# Altium project 1x9x1.PrjPcb
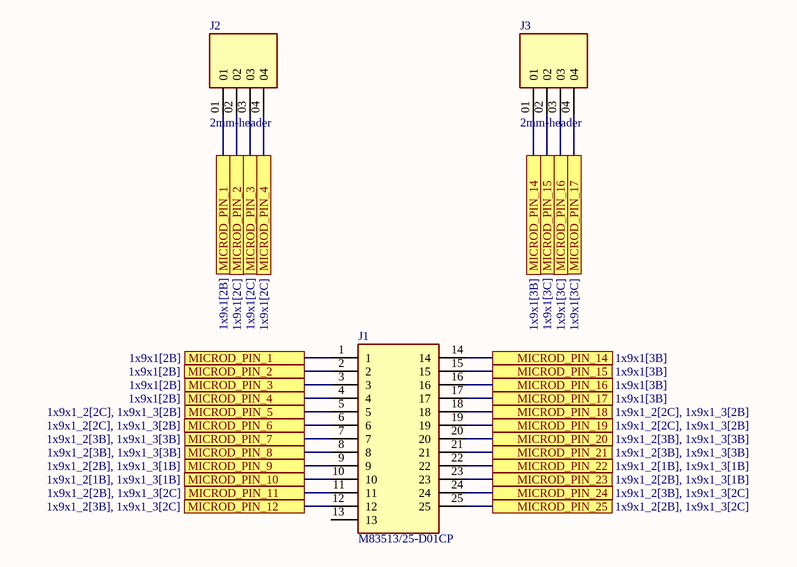
[diagram p0: 1x9x1.SchDoc]
3 sheets, 40 parts. Net scope: flat (ports and power ports of the same name join across sheets).
Board file: 1x9x1.PcbDoc
Sheets:
  1x9x1.SchDoc
  1x9x1_2.SchDoc
  1x9x1_3.SchDoc

## Sheet 1x9x1.SchDoc
size A; SheetNumber: 1; SheetTotal: 3

### Parts
J1  M83513/25-D01CP  [BEL_M83513/25-D01CP]
J2  2mm-header  [2mm-header]
J3  2mm-header  [2mm-header]

### Ports
MICROD_PIN_1 (see 1x9x1[2B]), MICROD_PIN_2 (see 1x9x1[2B]), MICROD_PIN_2 (see 1x9x1[2C]), MICROD_PIN_3 (see 1x9x1[2B]), MICROD_PIN_3 (see 1x9x1[2C]), MICROD_PIN_4 (see 1x9x1[2B]), MICROD_PIN_4 (see 1x9x1[2C]), MICROD_PIN_5 (see 1x9x1_2[2C], 1x9x1_3[2B]), MICROD_PIN_6 (see 1x9x1_2[2C], 1x9x1_3[2B]), MICROD_PIN_7 (see 1x9x1_2[3B], 1x9x1_3[3B]), MICROD_PIN_8 (see 1x9x1_2[3B], 1x9x1_3[3B]), MICROD_PIN_9 (see 1x9x1_2[2B], 1x9x1_3[1B]), MICROD_PIN_10 (see 1x9x1_2[1B], 1x9x1_3[1B]), MICROD_PIN_11 (see 1x9x1_2[2B], 1x9x1_3[2C]), MICROD_PIN_12 (see 1x9x1_2[3B], 1x9x1_3[2C]), MICROD_PIN_14 (see 1x9x1[3B]), MICROD_PIN_15 (see 1x9x1[3B]), MICROD_PIN_15 (see 1x9x1[3C]), MICROD_PIN_16 (see 1x9x1[3B]), MICROD_PIN_16 (see 1x9x1[3C]), MICROD_PIN_17 (see 1x9x1[3B]), MICROD_PIN_17 (see 1x9x1[3C]), MICROD_PIN_18 (see 1x9x1_2[2C], 1x9x1_3[2B]), MICROD_PIN_19 (see 1x9x1_2[2C], 1x9x1_3[2B]), MICROD_PIN_20 (see 1x9x1_2[3B], 1x9x1_3[3B]), MICROD_PIN_21 (see 1x9x1_2[3B], 1x9x1_3[3B]), MICROD_PIN_22 (see 1x9x1_2[1B], 1x9x1_3[1B]), MICROD_PIN_23 (see 1x9x1_2[2B], 1x9x1_3[1B]), MICROD_PIN_24 (see 1x9x1_2[3B], 1x9x1_3[2C]), MICROD_PIN_25 (see 1x9x1_2[2B], 1x9x1_3[2C])

### Nets
NetJ1_1: J1.1 J2.01 ; port MICROD_PIN_1
NetJ1_2: J1.2 J2.02 ; port MICROD_PIN_2
NetJ1_3: J1.3 J2.03 ; port MICROD_PIN_3
NetJ1_4: J1.4 J2.04 ; port MICROD_PIN_4
NetJ1_5: J1.5 ; port MICROD_PIN_5
NetJ1_6: J1.6 ; port MICROD_PIN_6
NetJ1_7: J1.7 ; port MICROD_PIN_7
NetJ1_8: J1.8 ; port MICROD_PIN_8
NetJ1_9: J1.9 ; port MICROD_PIN_9
NetJ1_10: J1.10 ; port MICROD_PIN_10
NetJ1_11: J1.11 ; port MICROD_PIN_11
NetJ1_12: J1.12 ; port MICROD_PIN_12
NetJ1_14: J1.14 J3.01 ; port MICROD_PIN_14
NetJ1_15: J1.15 J3.02 ; port MICROD_PIN_15
NetJ1_16: J1.16 J3.03 ; port MICROD_PIN_16
NetJ1_17: J1.17 J3.04 ; port MICROD_PIN_17
NetJ1_18: J1.18 ; port MICROD_PIN_18
NetJ1_19: J1.19 ; port MICROD_PIN_19
NetJ1_20: J1.20 ; port MICROD_PIN_20
NetJ1_21: J1.21 ; port MICROD_PIN_21
NetJ1_22: J1.22 ; port MICROD_PIN_22
NetJ1_23: J1.23 ; port MICROD_PIN_23
NetJ1_24: J1.24 ; port MICROD_PIN_24
NetJ1_25: J1.25 ; port MICROD_PIN_25

Not connected (* = marked no-connect by the designer): J1 13

### Library data of the parts
J1 = M83513/25-D01CP: MIL-DTL-83513 PCB Mounted Connector | Socket | 25 Positions | Shell Finish - Cadmium | Female | PCB Solder Pins | 0.109" (2.77 mm) Pin Length; Package: None; Price: None; Value: *; MP: M83513/25-D01CP; Availability: Unavailable
J2 J3 = 2mm-header: <a href="https://pricing.snapeda.com/parts/TSW-104-07-G-S/Samtec/view-part?ref=eda">Check availability</a>; MP: altium_native_batch; Package: None; Price: None; Value: *; Availability: Unavailable

## Sheet 1x9x1_2.SchDoc
size A; SheetNumber: 2; SheetTotal: 3
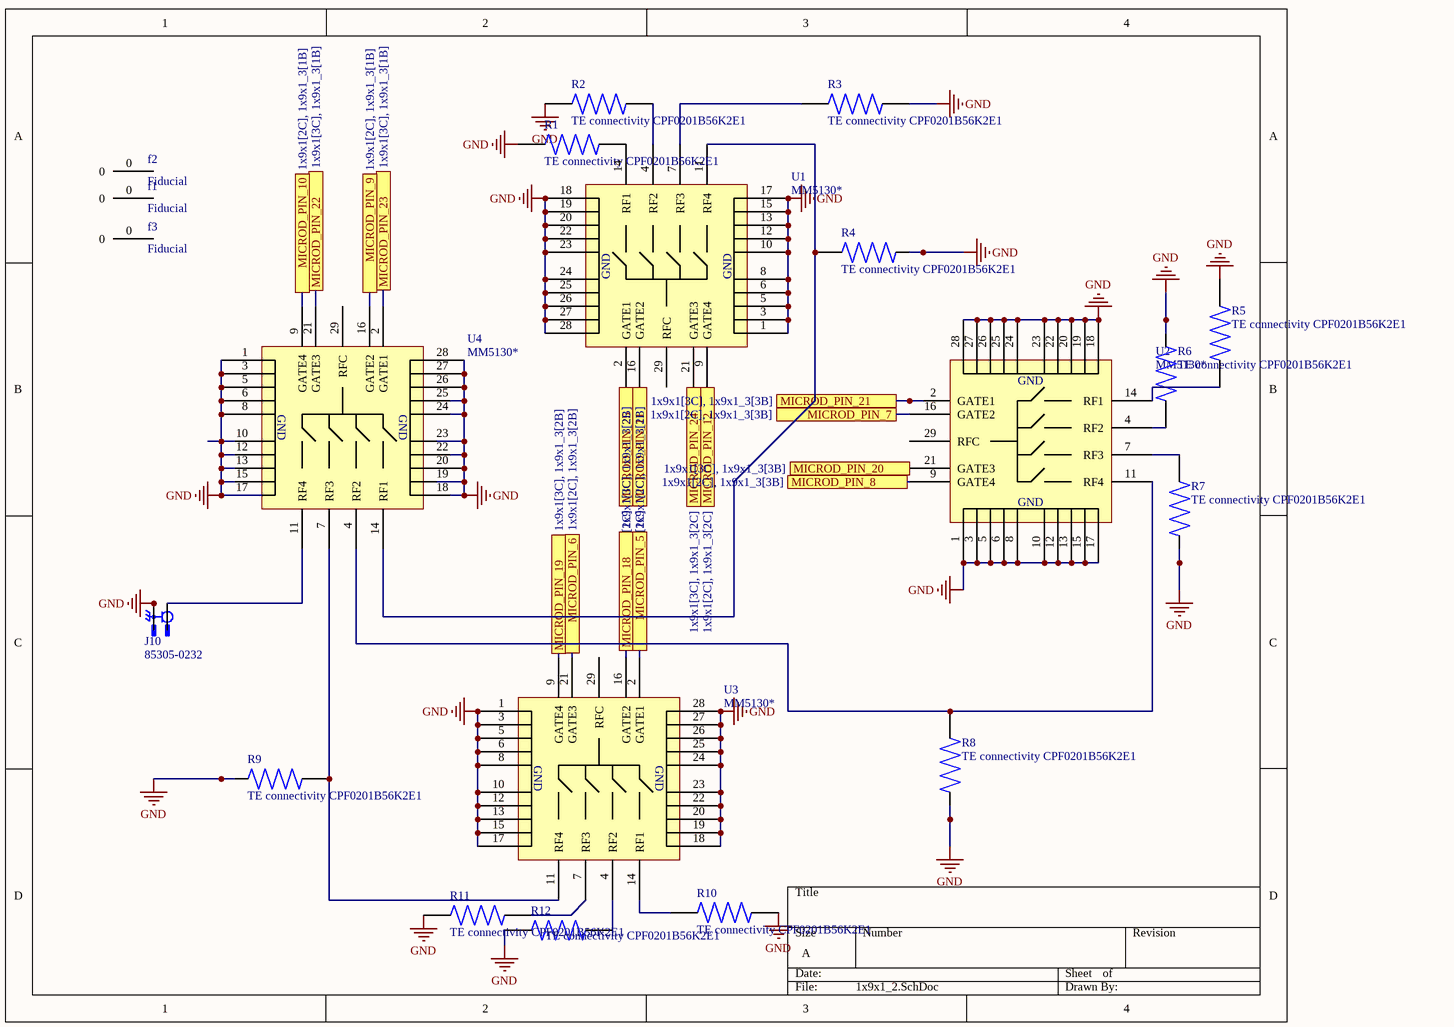
[diagram p1: 1x9x1_2.SchDoc]

### Parts
f1  Fiducial  [fiducial]
f2  Fiducial  [fiducial]
f3  Fiducial  [fiducial]
J10  85305-0232  [MOLEX_85305-0232]
R1  TE connectivity CPF0201B56K2E1  [0201-resistor]
R2  TE connectivity CPF0201B56K2E1  [0201-resistor]
R3  TE connectivity CPF0201B56K2E1  [0201-resistor]
R4  TE connectivity CPF0201B56K2E1  [0201-resistor]
R5  TE connectivity CPF0201B56K2E1  [0201-resistor]
R6  TE connectivity CPF0201B56K2E1  [0201-resistor]
R7  TE connectivity CPF0201B56K2E1  [0201-resistor]
R8  TE connectivity CPF0201B56K2E1  [0201-resistor]
R9  TE connectivity CPF0201B56K2E1  [0201-resistor]
R10  TE connectivity CPF0201B56K2E1  [0201-resistor]
R11  TE connectivity CPF0201B56K2E1  [0201-resistor]
R12  TE connectivity CPF0201B56K2E1  [0201-resistor]
U1  MM5130*  [MM5130-NORM_PCB_NOFLOOD]
U2  MM5130*  [MM5130-NORM_PCB_NOFLOOD]
U3  MM5130*  [MM5130-NORM_PCB_NOFLOOD]
U4  MM5130*  [MM5130-NORM_PCB_NOFLOOD]

### Ports
MICROD_PIN_5 (see 1x9x1[2C], 1x9x1_3[2B]), MICROD_PIN_6 (see 1x9x1[2C], 1x9x1_3[2B]), MICROD_PIN_7 (see 1x9x1[2C], 1x9x1_3[3B]), MICROD_PIN_8 (see 1x9x1[2C], 1x9x1_3[3B]), MICROD_PIN_9 (see 1x9x1[2C], 1x9x1_3[1B]), MICROD_PIN_10 (see 1x9x1[2C], 1x9x1_3[1B]), MICROD_PIN_11 (see 1x9x1[2C], 1x9x1_3[2C]), MICROD_PIN_12 (see 1x9x1[2C], 1x9x1_3[2C]), MICROD_PIN_18 (see 1x9x1[3C], 1x9x1_3[2B]), MICROD_PIN_19 (see 1x9x1[3C], 1x9x1_3[2B]), MICROD_PIN_20 (see 1x9x1[3C], 1x9x1_3[3B]), MICROD_PIN_21 (see 1x9x1[3C], 1x9x1_3[3B]), MICROD_PIN_22 (see 1x9x1[3C], 1x9x1_3[1B]), MICROD_PIN_23 (see 1x9x1[3C], 1x9x1_3[1B]), MICROD_PIN_24 (see 1x9x1[3C], 1x9x1_3[2C]), MICROD_PIN_25 (see 1x9x1[3C], 1x9x1_3[2C])

### Nets
GND: J10.2 J10.3 J10.4 J10.5 J10.6 J10.7 J10.8 J10.9 J10.10 J10.11 J10.12 J10.13 J10.14 J10.15 J10.16 J10.17 J10.18 R1.1 R2.2 R3.1 R4.1 R5.1 R6.1 R7.2 R8.2 R9.2 R10.1 R11.1 R12.2 U1.1(GND) U1.3(GND) U1.5(GND) U1.6(GND) U1.8(GND) U1.10(GND) U1.12(GND) U1.13(GND) U1.15(GND) U1.17(GND) U1.18(GND) U1.19(GND) U1.20(GND) U1.22(GND) U1.23(GND) U1.24(GND) U1.25(GND) U1.26(GND) U1.27(GND) U1.28(GND) U2.1(GND) U2.3(GND) U2.5(GND) U2.6(GND) U2.8(GND) U2.10(GND) U2.12(GND) U2.13(GND) U2.15(GND) U2.17(GND) U2.18(GND) U2.19(GND) U2.20(GND) U2.22(GND) U2.23(GND) U2.24(GND) U2.25(GND) U2.26(GND) U2.27(GND) U2.28(GND) U3.1(GND) U3.3(GND) U3.5(GND) U3.6(GND) U3.8(GND) U3.10(GND) U3.12(GND) U3.13(GND) U3.15(GND) U3.17(GND) U3.18(GND) U3.19(GND) U3.20(GND) U3.22(GND) U3.23(GND) U3.24(GND) U3.25(GND) U3.26(GND) U3.27(GND) U3.28(GND) U4.1(GND) U4.3(GND) U4.5(GND) U4.6(GND) U4.8(GND) U4.10(GND) U4.12(GND) U4.13(GND) U4.15(GND) U4.17(GND) U4.18(GND) U4.19(GND) U4.20(GND) U4.22(GND) U4.23(GND) U4.24(GND) U4.25(GND) U4.26(GND) U4.27(GND) U4.28(GND)
NetJ1_5: U3.2(GATE1) ; port MICROD_PIN_5
NetJ1_6: U3.21(GATE3) ; port MICROD_PIN_6
NetJ1_7: U2.16(GATE2) ; port MICROD_PIN_7
NetJ1_8: U2.9(GATE4) ; port MICROD_PIN_8
NetJ1_9: U4.16(GATE2) ; port MICROD_PIN_9
NetJ1_10: U4.9(GATE4) ; port MICROD_PIN_10
NetJ1_11: U1.16(GATE2) ; port MICROD_PIN_11
NetJ1_12: U1.9(GATE4) ; port MICROD_PIN_12
NetJ1_18: U3.16(GATE2) ; port MICROD_PIN_18
NetJ1_19: U3.9(GATE4) ; port MICROD_PIN_19
NetJ1_20: U2.21(GATE3) ; port MICROD_PIN_20
NetJ1_21: U2.2(GATE1) ; port MICROD_PIN_21
NetJ1_22: U4.21(GATE3) ; port MICROD_PIN_22
NetJ1_23: U4.2(GATE1) ; port MICROD_PIN_23
NetJ1_24: U1.21(GATE3) ; port MICROD_PIN_24
NetJ1_25: U1.2(GATE1) ; port MICROD_PIN_25
NetJ10_1: J10.1 U4.11(RF4)
NetR1_2: R1.2 U1.14(RF1)
NetR2_1: R2.1 U1.4(RF2)
NetR3_2: R3.2 U1.7(RF3)
NetR4_2: R4.2 U1.11(RF4) U4.14(RF1)
NetR5_2: R5.2 U2.14(RF1)
NetR6_2: R6.2 U2.4(RF2)
NetR7_1: R7.1 U2.7(RF3)
NetR8_1: R8.1 U2.11(RF4) U4.4(RF2)
NetR9_1: R9.1 U3.11(RF4) U4.7(RF3)
NetR10_2: R10.2 U3.14(RF1)
NetR11_2: R11.2 U3.7(RF3)
NetR12_1: R12.1 U3.4(RF2)

Not connected (* = marked no-connect by the designer): f1 0; f2 0; f3 0; U1 29(RFC); U2 29(RFC); U3 29(RFC); U4 29(RFC)

### Library data of the parts
J10 = 85305-0232: SMP Connector Plug, Male Pin 50Ohm Surface Mount Solder; MP: 853050232; MF: Molex; Check_prices: https://www.snapeda.com/parts/853050232/Molex/view-part/?ref=eda; Value: *; Availability: In Stock; Price: None; Package: None; SnapEDA_Link: https://www.snapeda.com/parts/853050232/Molex/view-part/?ref=snap; Purchase-URL: https://pricing.snapeda.com/search/part/853050232/?ref=eda
R1-R12 = TE connectivity CPF0201B56K2E1: CPF 0201 56K2 0.1% 25PPM 1K RL; MP: ERJ1GN0R00C; Value: 56k; Availability: Unavailable; Price: None; Package: None; Mfgr: TE connectivity; Mfgr Part No.: CPF0201B56K2E1
U1-U4 = IC-MM5130: High power SP4T MEMs switch

## Sheet 1x9x1_3.SchDoc
size A; SheetNumber: 3; SheetTotal: 3
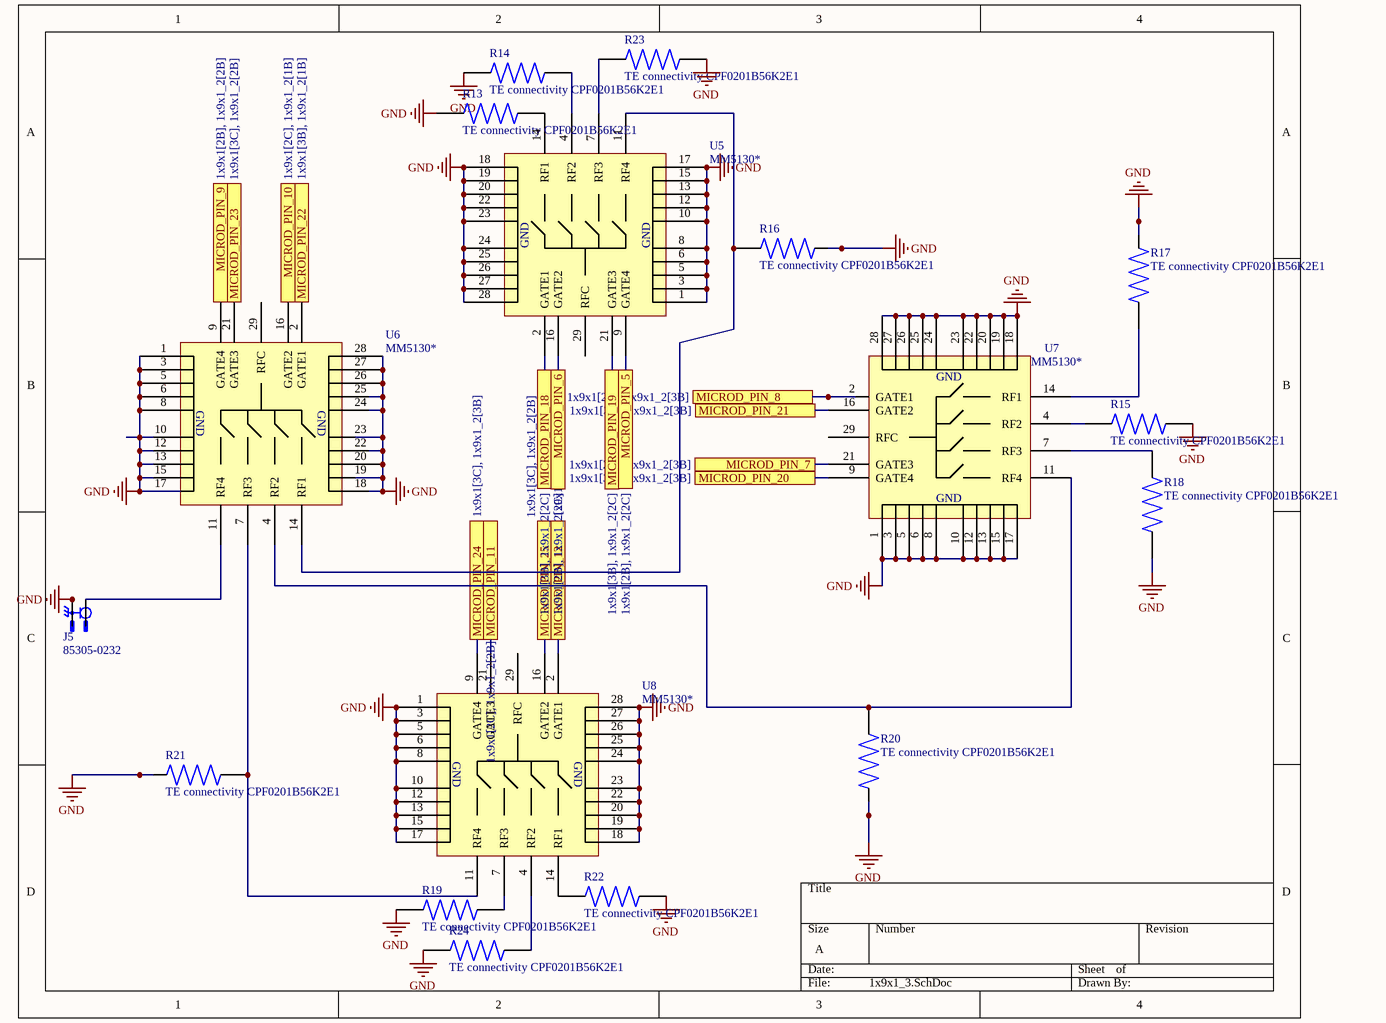
[diagram p2: 1x9x1_3.SchDoc]

### Parts
J5  85305-0232  [MOLEX_85305-0232]
R13  TE connectivity CPF0201B56K2E1  [0201-resistor]
R14  TE connectivity CPF0201B56K2E1  [0201-resistor]
R15  TE connectivity CPF0201B56K2E1  [0201-resistor]
R16  TE connectivity CPF0201B56K2E1  [0201-resistor]
R17  TE connectivity CPF0201B56K2E1  [0201-resistor]
R18  TE connectivity CPF0201B56K2E1  [0201-resistor]
R19  TE connectivity CPF0201B56K2E1  [0201-resistor]
R20  TE connectivity CPF0201B56K2E1  [0201-resistor]
R21  TE connectivity CPF0201B56K2E1  [0201-resistor]
R22  TE connectivity CPF0201B56K2E1  [0201-resistor]
R23  TE connectivity CPF0201B56K2E1  [0201-resistor]
R24  TE connectivity CPF0201B56K2E1  [0201-resistor]
U5  MM5130*  [MM5130-NORM_PCB_NOFLOOD]
U6  MM5130*  [MM5130-NORM_PCB_NOFLOOD]
U7  MM5130*  [MM5130-NORM_PCB_NOFLOOD]
U8  MM5130*  [MM5130-NORM_PCB_NOFLOOD]

### Ports
MICROD_PIN_5 (see 1x9x1[2B], 1x9x1_2[2C]), MICROD_PIN_6 (see 1x9x1[2B], 1x9x1_2[2C]), MICROD_PIN_7 (see 1x9x1[2B], 1x9x1_2[3B]), MICROD_PIN_8 (see 1x9x1[2B], 1x9x1_2[3B]), MICROD_PIN_9 (see 1x9x1[2B], 1x9x1_2[2B]), MICROD_PIN_10 (see 1x9x1[2C], 1x9x1_2[1B]), MICROD_PIN_11 (see 1x9x1[2C], 1x9x1_2[2B]), MICROD_PIN_12 (see 1x9x1[2C], 1x9x1_2[3B]), MICROD_PIN_18 (see 1x9x1[3B], 1x9x1_2[2C]), MICROD_PIN_19 (see 1x9x1[3B], 1x9x1_2[2C]), MICROD_PIN_20 (see 1x9x1[3B], 1x9x1_2[3B]), MICROD_PIN_21 (see 1x9x1[3B], 1x9x1_2[3B]), MICROD_PIN_22 (see 1x9x1[3B], 1x9x1_2[1B]), MICROD_PIN_23 (see 1x9x1[3C], 1x9x1_2[2B]), MICROD_PIN_24 (see 1x9x1[3C], 1x9x1_2[3B]), MICROD_PIN_25 (see 1x9x1[3C], 1x9x1_2[2B])

### Nets
GND: J5.2 J5.3 J5.4 J5.5 J5.6 J5.7 J5.8 J5.9 J5.10 J5.11 J5.12 J5.13 J5.14 J5.15 J5.16 J5.17 J5.18 R13.1 R14.2 R15.2 R16.1 R17.1 R18.1 R19.1 R20.2 R21.2 R22.1 R23.1 R24.1 U5.1(GND) U5.3(GND) U5.5(GND) U5.6(GND) U5.8(GND) U5.10(GND) U5.12(GND) U5.13(GND) U5.15(GND) U5.17(GND) U5.18(GND) U5.19(GND) U5.20(GND) U5.22(GND) U5.23(GND) U5.24(GND) U5.25(GND) U5.26(GND) U5.27(GND) U5.28(GND) U6.1(GND) U6.3(GND) U6.5(GND) U6.6(GND) U6.8(GND) U6.10(GND) U6.12(GND) U6.13(GND) U6.15(GND) U6.17(GND) U6.18(GND) U6.19(GND) U6.20(GND) U6.22(GND) U6.23(GND) U6.24(GND) U6.25(GND) U6.26(GND) U6.27(GND) U6.28(GND) U7.1(GND) U7.3(GND) U7.5(GND) U7.6(GND) U7.8(GND) U7.10(GND) U7.12(GND) U7.13(GND) U7.15(GND) U7.17(GND) U7.18(GND) U7.19(GND) U7.20(GND) U7.22(GND) U7.23(GND) U7.24(GND) U7.25(GND) U7.26(GND) U7.27(GND) U7.28(GND) U8.1(GND) U8.3(GND) U8.5(GND) U8.6(GND) U8.8(GND) U8.10(GND) U8.12(GND) U8.13(GND) U8.15(GND) U8.17(GND) U8.18(GND) U8.19(GND) U8.20(GND) U8.22(GND) U8.23(GND) U8.24(GND) U8.25(GND) U8.26(GND) U8.27(GND) U8.28(GND)
NetJ1_5: U5.9(GATE4) ; port MICROD_PIN_5
NetJ1_6: U5.16(GATE2) ; port MICROD_PIN_6
NetJ1_7: U7.21(GATE3) ; port MICROD_PIN_7
NetJ1_8: U7.2(GATE1) ; port MICROD_PIN_8
NetJ1_9: U6.9(GATE4) ; port MICROD_PIN_9
NetJ1_10: U6.16(GATE2) ; port MICROD_PIN_10
NetJ1_11: U8.21(GATE3) ; port MICROD_PIN_11
NetJ1_12: U8.2(GATE1) ; port MICROD_PIN_12
NetJ1_18: U5.2(GATE1) ; port MICROD_PIN_18
NetJ1_19: U5.21(GATE3) ; port MICROD_PIN_19
NetJ1_20: U7.9(GATE4) ; port MICROD_PIN_20
NetJ1_21: U7.16(GATE2) ; port MICROD_PIN_21
NetJ1_22: U6.2(GATE1) ; port MICROD_PIN_22
NetJ1_23: U6.21(GATE3) ; port MICROD_PIN_23
NetJ1_24: U8.9(GATE4) ; port MICROD_PIN_24
NetJ1_25: U8.16(GATE2) ; port MICROD_PIN_25
NetJ5_1: J5.1 U6.11(RF4)
NetR13_2: R13.2 U5.14(RF1)
NetR14_1: R14.1 U5.4(RF2)
NetR15_1: R15.1 U7.4(RF2)
NetR16_2: R16.2 U5.11(RF4) U6.14(RF1)
NetR17_2: R17.2 U7.14(RF1)
NetR18_2: R18.2 U7.7(RF3)
NetR19_2: R19.2 U8.7(RF3)
NetR20_1: R20.1 U6.4(RF2) U7.11(RF4)
NetR21_1: R21.1 U6.7(RF3) U8.11(RF4)
NetR22_2: R22.2 U8.14(RF1)
NetR23_2: R23.2 U5.7(RF3)
NetR24_2: R24.2 U8.4(RF2)

Not connected (* = marked no-connect by the designer): U5 29(RFC); U6 29(RFC); U7 29(RFC); U8 29(RFC)

### Library data of the parts
J5 = 85305-0232: as J10 on sheet 1x9x1_2; Check_prices: https://www.snapeda.com/parts/853050232/Molex/view-part/?ref=eda; Value: *; Availability: In Stock; Price: None; Package: None; SnapEDA_Link: https://www.snapeda.com/parts/853050232/Molex/view-part/?ref=snap; Purchase-URL: https://pricing.snapeda.com/search/part/853050232/?ref=eda
R13-R24 = TE connectivity CPF0201B56K2E1: as R1 on sheet 1x9x1_2; Availability: Unavailable; Price: None; Package: None; Mfgr: TE connectivity; Mfgr Part No.: CPF0201B56K2E1
U5-U8 = IC-MM5130: High power SP4T MEMs switch

## Nets that join several sheets
GND: 1x9x1_2 (109 pins), 1x9x1_3 (109 pins)
NetJ1_5: 1x9x1 (J1.5), 1x9x1_2 (U3.2), 1x9x1_3 (U5.9)
NetJ1_6: 1x9x1 (J1.6), 1x9x1_2 (U3.21), 1x9x1_3 (U5.16)
NetJ1_7: 1x9x1 (J1.7), 1x9x1_2 (U2.16), 1x9x1_3 (U7.21)
NetJ1_8: 1x9x1 (J1.8), 1x9x1_2 (U2.9), 1x9x1_3 (U7.2)
NetJ1_9: 1x9x1 (J1.9), 1x9x1_2 (U4.16), 1x9x1_3 (U6.9)
NetJ1_10: 1x9x1 (J1.10), 1x9x1_2 (U4.9), 1x9x1_3 (U6.16)
NetJ1_11: 1x9x1 (J1.11), 1x9x1_2 (U1.16), 1x9x1_3 (U8.21)
NetJ1_12: 1x9x1 (J1.12), 1x9x1_2 (U1.9), 1x9x1_3 (U8.2)
NetJ1_18: 1x9x1 (J1.18), 1x9x1_2 (U3.16), 1x9x1_3 (U5.2)
NetJ1_19: 1x9x1 (J1.19), 1x9x1_2 (U3.9), 1x9x1_3 (U5.21)
NetJ1_20: 1x9x1 (J1.20), 1x9x1_2 (U2.21), 1x9x1_3 (U7.9)
NetJ1_21: 1x9x1 (J1.21), 1x9x1_2 (U2.2), 1x9x1_3 (U7.16)
NetJ1_22: 1x9x1 (J1.22), 1x9x1_2 (U4.21), 1x9x1_3 (U6.2)
NetJ1_23: 1x9x1 (J1.23), 1x9x1_2 (U4.2), 1x9x1_3 (U6.21)
NetJ1_24: 1x9x1 (J1.24), 1x9x1_2 (U1.21), 1x9x1_3 (U8.9)
NetJ1_25: 1x9x1 (J1.25), 1x9x1_2 (U1.2), 1x9x1_3 (U8.16)